# EAGLE design Mainboard (EAGLE 7.2.0)
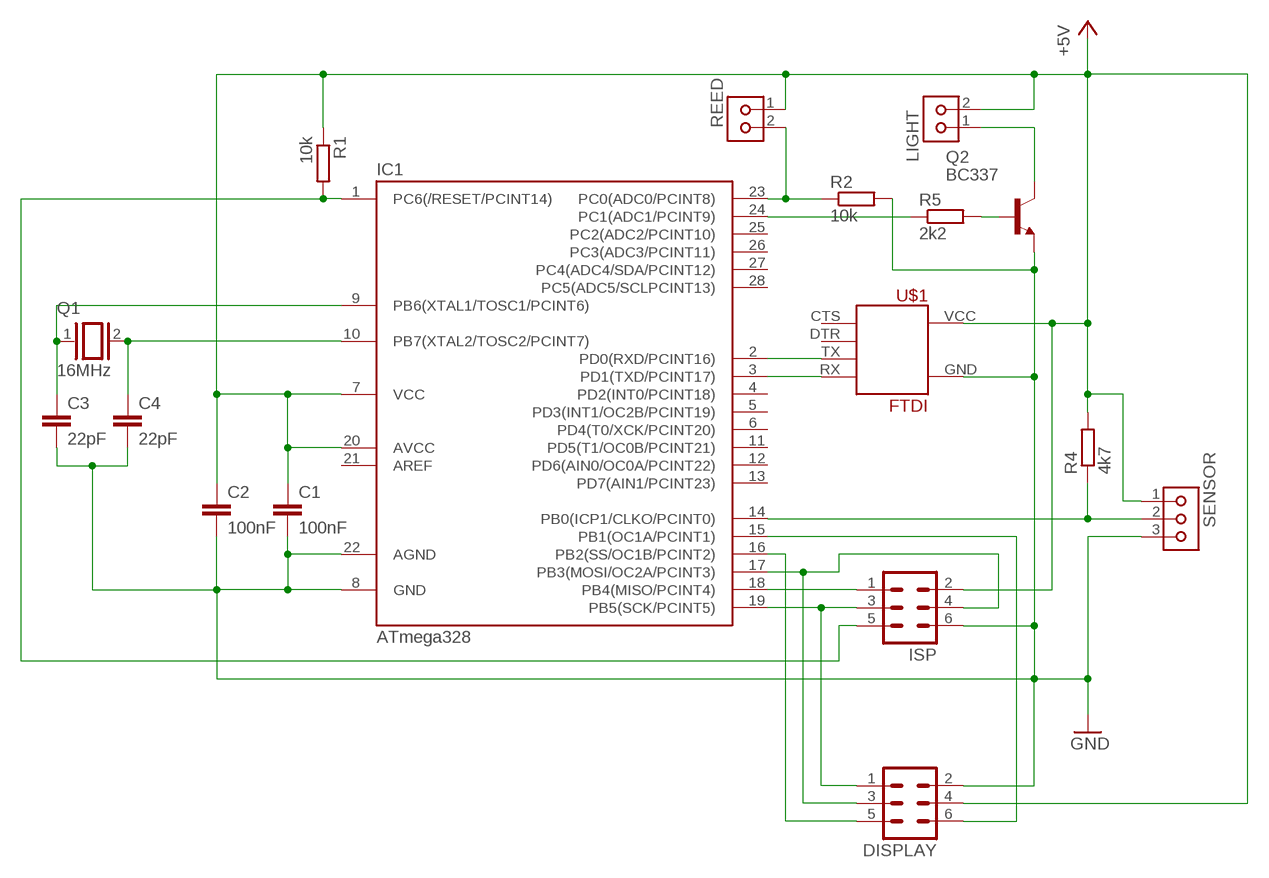
[diagram p0: schematic, sheet 1]

## Parts
C1  100nF  C-EU050-025X075  [C050-025X075]
C2  100nF  C-EU025-025X050  [C025-025X050]
C3  22pF  C-EU025-025X050  [C025-025X050]
C4  22pF  C-EU025-025X050  [C025-025X050]
DISPLAY  ML6  [ML6]
IC1  ATmega328  MEGA48/88/168-PU  [DIL28-3]
ISP  ML6  [ML6]
LIGHT  KK2VSQ  [KK-V-2-SQ]
Q1  16MHz  XTAL/S  [QS]
Q2  BC337  [TO92-STRAIGHT-0.254]
R1  10k  R-EU_0207/10  [0207/10]
R2  10k  R-EU_0204/2V  [0204V]
R4  4k7  R-EU_0204/7  [0204/7]
R5  2k2  R-EU_0204/7  [0204/7]
REED  KK2VSQ  [KK-V-2-SQ]
SENSOR  KK3V  [KK-V-3]
U$1  FTDI  [FTDI-1]

## Nets
+5V: C1.1 C2.1 DISPLAY.4 IC1.7(VCC) IC1.20(AVCC) ISP.2 LIGHT.2 R1.1 R4.2 REED.1 SENSOR.1 U$1.VCC(+5V)
GND: C1.2 C2.2 C3.2 C4.2 DISPLAY.2 IC1.8(GND) IC1.22(AGND) ISP.6 Q2.3(E) R2.2 SENSOR.3 U$1.GND
N$1: Q2.2(B) R5.2
N$2: IC1.24(PC1(ADC1/PCINT9)) R5.1
N$3: IC1.2(PD0(RXD/PCINT16)) U$1.TX
N$4: IC1.3(PD1(TXD/PCINT17)) U$1.RX
N$5: C3.1 IC1.9(PB6(XTAL1/TOSC1/PCINT6)) Q1.1
N$6: C4.1 IC1.10(PB7(XTAL2/TOSC2/PCINT7)) Q1.2
N$7: DISPLAY.3 IC1.17(PB3(MOSI/OC2A/PCINT3)) ISP.4
N$8: IC1.1(PC6(/RESET/PCINT14)) ISP.5 R1.2
N$9: IC1.23(PC0(ADC0/PCINT8)) R2.1 REED.2
N$10: IC1.14(PB0(ICP1/CLKO/PCINT0)) R4.1 SENSOR.2
N$11: LIGHT.1 Q2.1(C)
N$12: DISPLAY.5 IC1.16(PB2(SS/OC1B/PCINT2))
N$13: IC1.18(PB4(MISO/PCINT4)) ISP.1
N$14: DISPLAY.1 IC1.19(PB5(SCK/PCINT5)) ISP.3
N$16: DISPLAY.6 IC1.15(PB1(OC1A/PCINT1))
Unconnected: IC1.4(PD2(INT0/PCINT18)) IC1.5(PD3(INT1/OC2B/PCINT19)) IC1.6(PD4(T0/XCK/PCINT20)) IC1.11(PD5(T1/OC0B/PCINT21)) IC1.12(PD6(AIN0/OC0A/PCINT22)) IC1.13(PD7(AIN1/PCINT23)) IC1.21(AREF) IC1.25(PC2(ADC2/PCINT10)) IC1.26(PC3(ADC3/PCINT11)) IC1.27(PC4(ADC4/SDA/PCINT12)) IC1.28(PC5(ADC5/SCLPCINT13)) U$1.CTS U$1.DTR

## Library data of the parts
C1-C4 = rcl:C-EU: CAPACITOR, European symbol
DISPLAY ISP = con-ml:ML6: HARTING; OC_FARNELL: unknown; OC_NEWARK: unknown
IC1 = avr-7:MEGA48/88/168-PU
LIGHT REED = molex-kk:KK2*: Molex KK 2-pin connector, 100 mil pin spacing
Q1 = special:XTAL/S: CRYSTAL
Q2 = Zap-Verbogene Teile:BC337: NPN Transistor
R1 R2 R4 R5 = rcl:R-EU_: RESISTOR, European symbol
SENSOR = molex-kk:KK3*: Molex KK 3-pin connector, 100 mil pin spacing
U$1 = Zap-USB-Breakouts:FTDI

## Board
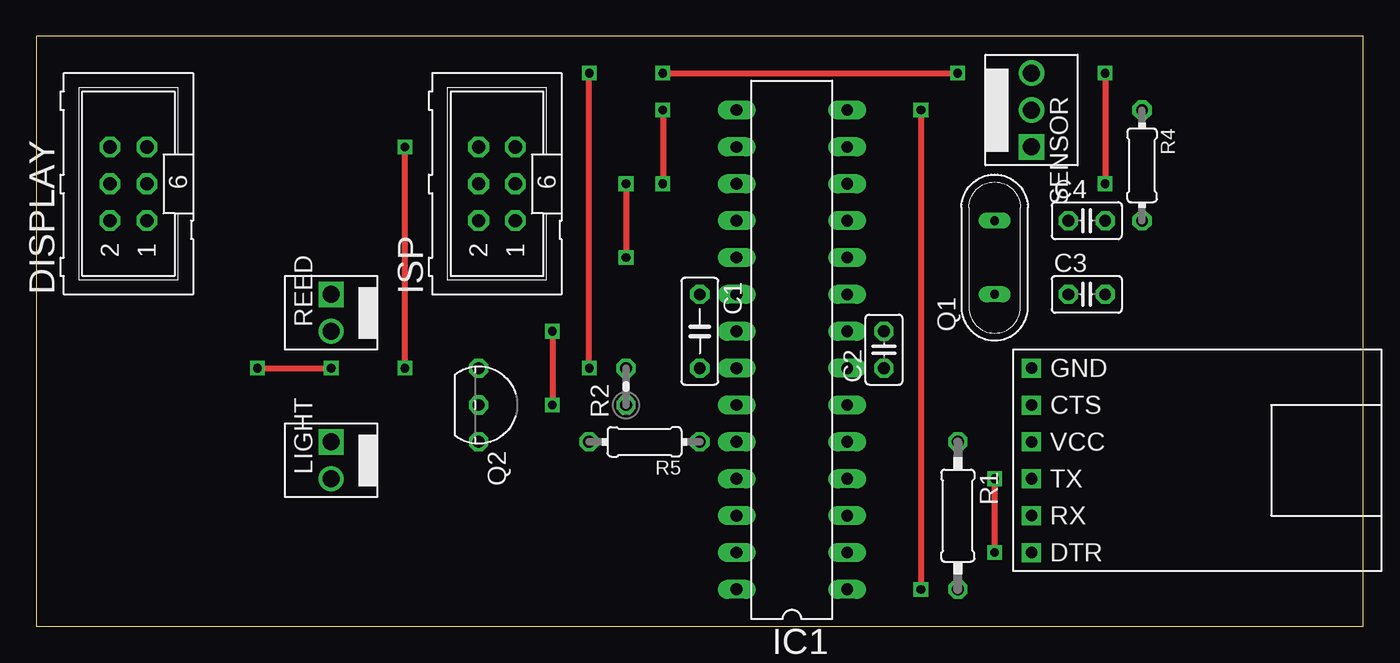
[diagram p1: board, top side]
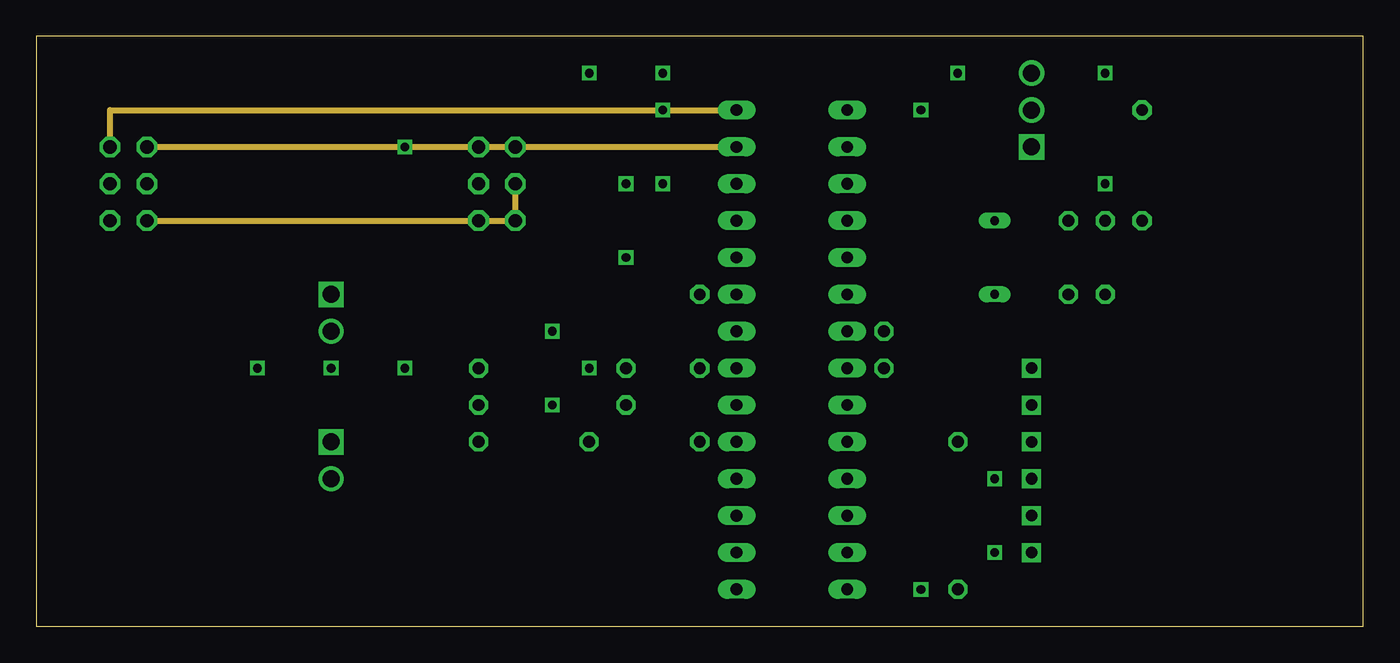
[diagram p2: board, inner layer LoseKabel]
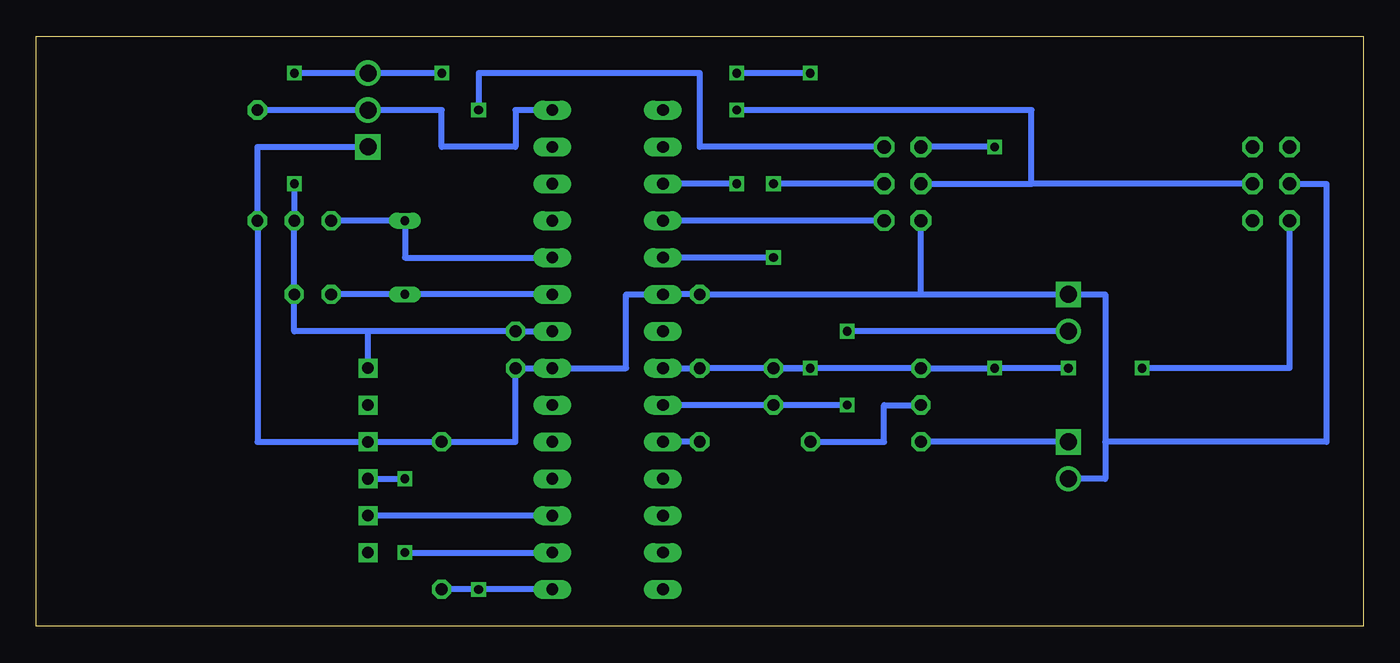
[diagram p3: board, bottom side, seen from below]

Size 91.44 x 40.64 mm. Coordinates in mm from the lower left corner, seen from the top.
Outline: 0,0 91.44,0 91.44,40.64 0,40.64 0,0
Copper layers (1*2*16): Top 0.035mm / dielectric 1.5mm / LoseKabel 0.035mm / dielectric 0.15mm / Bottom 0.035mm
Design rules "default *": minimum track width 10mil, minimum drill 24mil, track to track 8mil, track to pad 8mil, pad to pad 8mil, via to via 8mil, smd to smd 8mil, copper to edge 40mil, drill to drill 8mil, minimum pad ring 10mil, minimum via ring 8mil, stop-mask expansion 4mil, vias tented up to drill 0mil, thermal gap 10mil

### Footprints (pad centres in the part's own frame; a part is rotated, then mirrored left to right if it is on the bottom)
C050-025X075 = drill 0.813 octagon: 1 -2.54,0; 2 2.54,0
C025-025X050 = drill 0.813 octagon: 1 -1.27,0; 2 1.27,0
ML6 = drill 0.914 octagon: 1 -2.54,-1.27; 2 -2.54,1.27; 3 0,-1.27; 4 0,1.27; 5 2.54,-1.27; 6 2.54,1.27
DIL28-3 = drill 0.813 long: 1 -16.51,-3.81; 2 -13.97,-3.81; 3 -11.43,-3.81; 4 -8.89,-3.81; 5 -6.35,-3.81; 6 -3.81,-3.81; 7 -1.27,-3.81; 8 1.27,-3.81; 9 3.81,-3.81; 10 6.35,-3.81; 11 8.89,-3.81; 12 11.43,-3.81; 13 13.97,-3.81; 14 16.51,-3.81; 15 16.51,3.81; 16 13.97,3.81; 17 11.43,3.81; 18 8.89,3.81; 19 6.35,3.81; 20 3.81,3.81; 21 1.27,3.81; 22 -1.27,3.81; 23 -3.81,3.81; 24 -6.35,3.81; 25 -8.89,3.81; 26 -11.43,3.81; 27 -13.97,3.81; 28 -16.51,3.81
KK-V-2-SQ = drill 1.168 square: 1 0,1.27 | drill 1.168: 2 0,-1.27
QS = drill 0.61 long: 1 -2.54,0; 2 2.54,0
TO92-STRAIGHT-0.254 = drill 0.813 octagon: 1 2.54,0; 2 0,0; 3 -2.54,0
0207/10 = drill 0.813 octagon: 1 -5.08,0; 2 5.08,0
0204V = drill 0.813 octagon: 1 -1.27,0; 2 1.27,0
0204/7 = drill 0.813 octagon: 1 -3.81,0; 2 3.81,0
KK-V-3 = drill 1.168 square: 1 0,2.54 | drill 1.168: 2 0,0; 3 0,-2.54
FTDI-1 = drill 0.8 square: CTS -11.43,3.81; DTR -11.43,-6.35; GND -11.43,6.35; RX -11.43,-3.81; TX -11.43,-1.27; VCC -11.43,1.27

### Placement (x,y rotation side)
C1  45.72,20.32 270 top
C2  58.42,19.05 90 top
C3  72.39,22.86 0 top
C4  72.39,27.94 0 top
DISPLAY  6.35,30.48 90 top
IC1  52.07,19.05 90 top
ISP  31.75,30.48 90 top
LIGHT  20.32,11.43 0 top
Q1  66.04,25.4 90 top
Q2  30.48,15.24 270 top
R1  63.5,7.62 270 top
R2  40.64,16.51 90 top
R4  76.2,31.75 270 top
R5  41.91,12.7 180 top
REED  20.32,21.59 0 top
SENSOR  68.58,35.56 180 top
U$1  80.01,11.43 0 top

### Tracks (layer width: path | path; a pad name or v marks a point on that pad's centre or on a via)
+5V
  Bottom 0.406: SENSOR.1 76.2,33.02 R4.2 76.2,12.7 U$1.VCC R1.1 58.42,12.7 C2.1 IC1.7 50.8,17.78 50.8,22.86 IC1.20 C1.1 30.48,22.86 | 30.48,22.86 REED.1 17.78,22.86 17.78,12.7 | 17.78,12.7 17.78,10.16 LIGHT.2 | 30.48,22.86 ISP.2 | DISPLAY.4 2.54,30.48 2.54,12.7 17.78,12.7
GND  (via drill 0.6)
  Top 0.406: v73.66,38.1 v73.66,30.48 | v25.4,17.78 v25.4,33.02 | v38.1,17.78 v38.1,38.1 | v43.18,38.1 v63.5,38.1 | v15.24,17.78 v20.32,17.78
  Bottom 0.406: 68.58,20.32 C2.2 IC1.8 | 68.58,20.32 73.66,20.32 C3.2 C4.2 v73.66,30.48 | U$1.GND 68.58,20.32 | v73.66,38.1 SENSOR.3 v63.5,38.1 | v25.4,33.02 ISP.6 | IC1.22 C1.2 v38.1,17.78 R2.2 Q2.3 v25.4,17.78 v20.32,17.78 | v38.1,38.1 v43.18,38.1 | DISPLAY.2 5.08,17.78 v15.24,17.78
N$1
  Bottom 0.406: R5.2 33.02,12.7 33.02,15.24 Q2.2
N$2
  Bottom 0.406: R5.1 IC1.24
N$3  (via drill 0.6)
  Top 0.406: v66.04,10.16 v66.04,5.08
  Bottom 0.406: U$1.TX v66.04,10.16 | v66.04,5.08 IC1.2
N$4
  Bottom 0.406: IC1.3 U$1.RX
N$5
  Bottom 0.406: C3.1 Q1.1 IC1.9
N$6
  Bottom 0.406: C4.1 Q1.2 66.04,25.4 IC1.10
N$7  (via drill 0.6)
  Top 0.406: v43.18,35.56 v43.18,30.48
  Bottom 0.406: ISP.4 22.86,30.48 | 22.86,30.48 22.86,35.56 v43.18,35.56 | v43.18,30.48 IC1.17 | DISPLAY.3 22.86,30.48
N$8  (via drill 0.6)
  Top 0.406: v60.96,35.56 v60.96,2.54
  Bottom 0.406: IC1.1 v60.96,2.54 R1.2 | ISP.5 45.72,33.02 45.72,38.1 60.96,38.1 v60.96,35.56
N$9  (via drill 0.6)
  Top 0.406: v35.56,20.32 v35.56,15.24
  Bottom 0.406: REED.2 v35.56,20.32 | v35.56,15.24 R2.1 IC1.23
N$10
  Bottom 0.406: IC1.14 58.42,35.56 58.42,33.02 63.5,33.02 63.5,35.56 SENSOR.2 R4.1
N$11
  Bottom 0.406: LIGHT.1 Q2.1
N$12
  LoseKabel 0.406: DISPLAY.5 IC1.16
N$13
  Bottom 0.406: ISP.1 IC1.18
N$14  (via drill 0.6)
  Top 0.406: v40.64,30.48 v40.64,25.4
  LoseKabel 0.406: DISPLAY.1 33.02,27.94 ISP.3
  Bottom 0.406: ISP.3 v40.64,30.48 | v40.64,25.4 IC1.19
N$16
  LoseKabel 0.406: DISPLAY.6 5.08,35.56 IC1.15